# Altium project PCB_Project1.PrjPCB
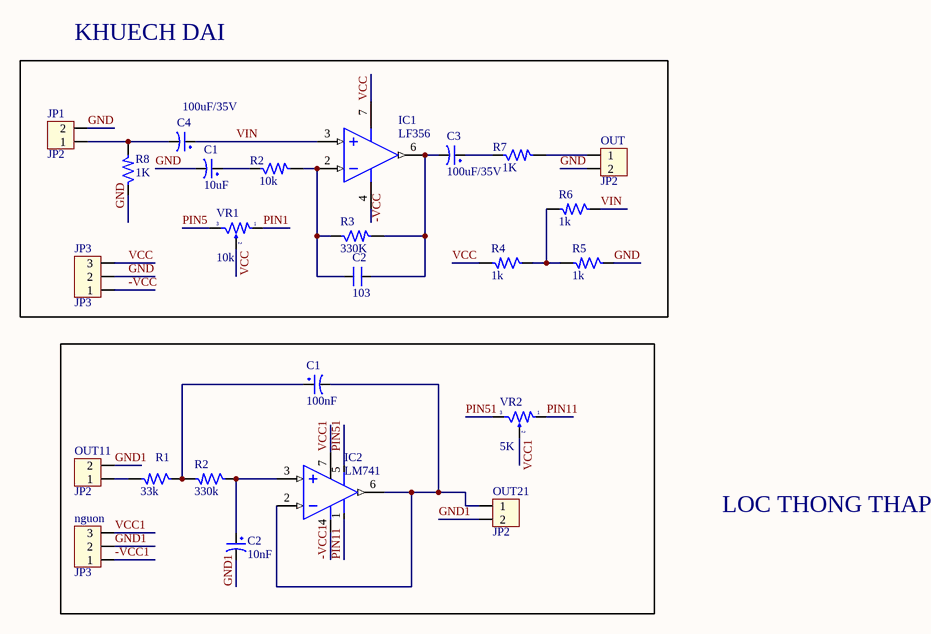
[diagram p0: MACH.SchDoc]
2 sheets, 40 parts. Net scope: global (net labels, ports and power ports of the same name join across sheets).
Board file: PCB1.PcbDoc
Sheets:
  MACH.SchDoc
  MACH2.SchDoc

## Sheet MACH.SchDoc
size A3

### Parts
(Parts that share a designator on the sheet are numbered #1, #2 ... from top to bottom, then left to right.)
C1#1  10uF  [CP1/2]
C1#2  100nF  [CP1/2]
C2#1  103  [CP1/2]
C2#2  10nF  [CP1/2]
C3  100uF/35V  [CP1.5/3.4]
C4  100uF/35V  [CP1.5/3.4]
IC1  LF356  [DIP8/W0.3]
IC2  LM741  [DIP8/W0.3]
JP1  JP2  [CON2]
JP3  JP3  [CON3]
nguon#1  JP3  [CON3]
OUT  JP2  [CON2]
OUT11  JP2  [CON2]
OUT21  JP2  [CON2]
R1#1  33k  [R1/2W]
R2#1  10k  [R1/2W]
R2#2  330k  [R1/2W]
R3  330K  [R1/2W]
R4  1k  [R1/2W]
R5  1k  [R1/2W]
R6  1k  [R1/2W]
R7  1K  [R1/2W]
R8  1K  [R1/2W]
VR1  10k  [VR]
VR2  5K  [VR]

### Blocks framed on the sheet
KHUECH DAI: C1#1 C2#1 C3 C4 IC1 JP1 JP3 OUT R2#1 R3-R8 VR1

### Nets
GND: C1#1.2 JP1.2 JP3.2 OUT.2 R5.1 R8.1
VCC: IC1.7(V+) JP3.3 R4.2 VR1.2
-VCC: JP3.1
-VCC1: IC2.4(-V) nguon#1.1
GND1: C2#2.2 nguon#1.2 OUT11.2 OUT21.2
PIN1: VR1.1
PIN5: VR1.3
PIN11: IC2.1(Vos) VR2.1
PIN51: IC2.5(Vos) VR2.3
VCC1: IC2.7(+V) nguon#1.3 VR2.2
VIN: C4.1 IC1.3(IN+) R6.1
NetC1#1_1: C1#1.1 R2#1.1
NetC1#2_1: C1#2.1 R1#1.1 R2#2.2
NetC1#2_2: C1#2.2 IC2.2(IN-) IC2.6(OUT) OUT21.1
NetC2#1_1: C2#1.1 IC1.2(IN-) R2#1.2 R3.1
NetC2#1_2: C2#1.2 C3.2 IC1.6(OUT) R3.2
NetC2#2_1: C2#2.1 IC2.3(IN+) R2#2.1
NetC3_1: C3.1 R7.1
NetC4_2: C4.2 JP1.1 R8.2
NetOUT11_1: OUT11.1 R1#1.2
NetOUT_1: OUT.1 R7.2
NetR4_1: R4.1 R5.2 R6.2

Not connected (* = marked no-connect by the designer): IC1 4(V-)

### Notes on the sheet
- LOC THONG THAP
- Labels drawn without touching a wire or pin: -VCC
- Title
- Size:
- Date:
- A3
- Number:
- Time:
- Revision:
- Sheet
- of
- File:

### Library data of the parts
C1#1 C1#2 C2#2 = CP1: Cap P  0,1uF < 22uF , 16 - 50V; Value: 10uF/50V; Description 1: 10 => 220uF/6,3V/10V - 10uF => 100uF/16V; Description 2: 0,1uF => 33uF/50V - 10uF => 22uF/63V; Description 3: 0,47uF => 10uF/100V
C2#1 = CM: Cap SMD; Value: 103
C3 C4 = CP3: Cap 100uF/35V - 470uF/16V; Value: 100uF/35V/50V; Description 1: 1000uF/6,3V - 470uF/16V - 330uF - 25V; Description 2: 220uF/35V - 100uF/50V - 63V - 4,7uF/200V; Description 3: 22uF => 33uF100V - 3,3uF => 4,7uF/250V; Description 4: 2,2uF =>3,3uF/350 - 2,2uF/400V - 1uF/450V
IC1 = LF356: Wide-Bandwidth Single JFET Input Operational Amplifier; Published: 15-Apr-2002; LatestRevisionDate: 06-Jun-2005; LatestRevisionNote: Stylized 3D Model Added.; DatasheetDocument: Apr-1998; PackageDocument: Sep-1997; Publisher: Altium Limited; ComponentLink1Description: Manufacturer Link; ComponentLink1URL: http://www.national.com/; ComponentLink2Description: Datasheet; ComponentLink2URL: http://www.national.com/ds.cgi/LF/LF353.pdf; ComponentLink3Description: URL Link1; ComponentLink3URL: http://www.national.com/pf/LF/LF353.html; Value: LF356
IC2 = LM741: Single OA
JP1 OUT OUT11 OUT21 = Con2: Connector 2; Value: Connector 2
JP3 nguon#1 = Con3: Connector 3; Value: Connector 3
R1#1 R2#1 R2#2 R3-R8 = R: Resistor 1/4W; Value: R1/4W - 1K
VR1 VR2 = VOL-S: Var Resistor; Value: Volume 50k

## Sheet MACH2.SchDoc
size A4
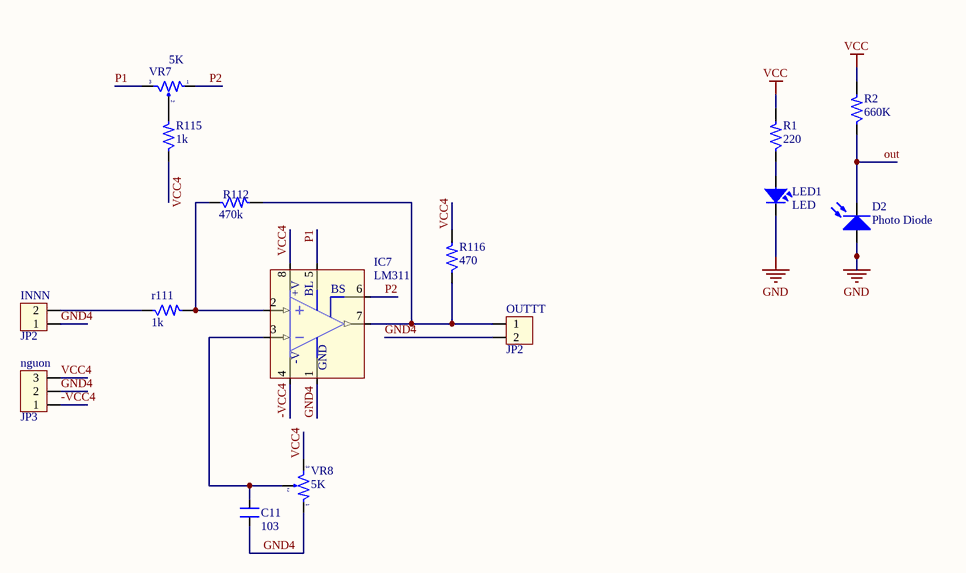
[diagram p1: MACH2.SchDoc]

### Parts
(Parts that share a designator on the sheet are numbered #1, #2 ... from top to bottom, then left to right.)
C11  103  [SM-0805]
D2  Photo Diode  [LED-5 GRe]
IC7  LM311  [DIP8/W0.3]
INNN  JP2  [CON2]
LED1  LED  [LED-3]
nguon#2  JP3  [CON3]
OUTTT  JP2  [CON2]
R1#2  220  [SM-1206]
R2#3  660K  [SM-1206]
r111  1k  [SM-1206]
R112  470k  [SM-1206]
R115  1k  [SM-1206]
R116  470  [SM-1206]
VR7  5K  [VR]
VR8  5K  [VR]

### Nets
GND: D2.1(A) LED1.2
VCC: R1#2.2 R2#3.2
-VCC4: IC7.4(GND) nguon#2.1
GND4: C11.1 IC7.1(F2) INNN.1 nguon#2.2 OUTTT.2 VR8.1
out: D2.2(K) R2#3.1
P1: IC7.5(F1) VR7.3
P2: IC7.6(F2) VR7.1
VCC4: IC7.8(V+) nguon#2.3 R115.1 R116.2 VR8.3
NetC11_2: C11.2 IC7.3(IN-) VR8.2
NetIC7_2: IC7.2(IN+) r111.2 R112.1
NetIC7_7: IC7.7(OUT) OUTTT.1 R112.2 R116.1
NetINNN_2: INNN.2 r111.1
NetLED1_1: LED1.1 R1#2.1
NetR115_2: R115.2 VR7.2

### Notes on the sheet
- (in symbol LM311) +V; BL; BS; -V

### Library data of the parts
C11 = CM: Cap SMD; Value: 103
D2 = Photo Diode: Photosensitive Diode
IC7 = LM311: Voltage Comparator; Value: DIP 8; Value: LM311
INNN OUTTT = Con2: Connector 2; Value: Connector 2
LED1 = LED: LED Single colour Green and Red; Value: LED 3 ly Single Colour; Description: LED 5 ly Single Colour; Description: Led  Vuong
nguon#2 = Con3: Connector 3; Value: Connector 3
R1#2 R2#3 r111 R112 R115 R116 = R: Resistor 1/4W; Value: R1/4W - 1K
VR7 VR8 = VOL-S: Var Resistor; Value: Volume 50k

## Nets that join several sheets
GND: MACH (6 pins), MACH2 (D2.1 LED1.2)
VCC: MACH (IC1.7 JP3.3 R4.2 VR1.2), MACH2 (R1#2.2 R2#3.2)